# EasyEDA schematic SCH_ACVoltageSensor_2025-03-02.json
TITLE: Sensor de tensão monofásica AC 150V; REV: 1.0; Date: 2025-02-28; Sheet: 1/1; Drawn By: Lucas Yukio Fukuda Matsumoto; Company: UTFPR
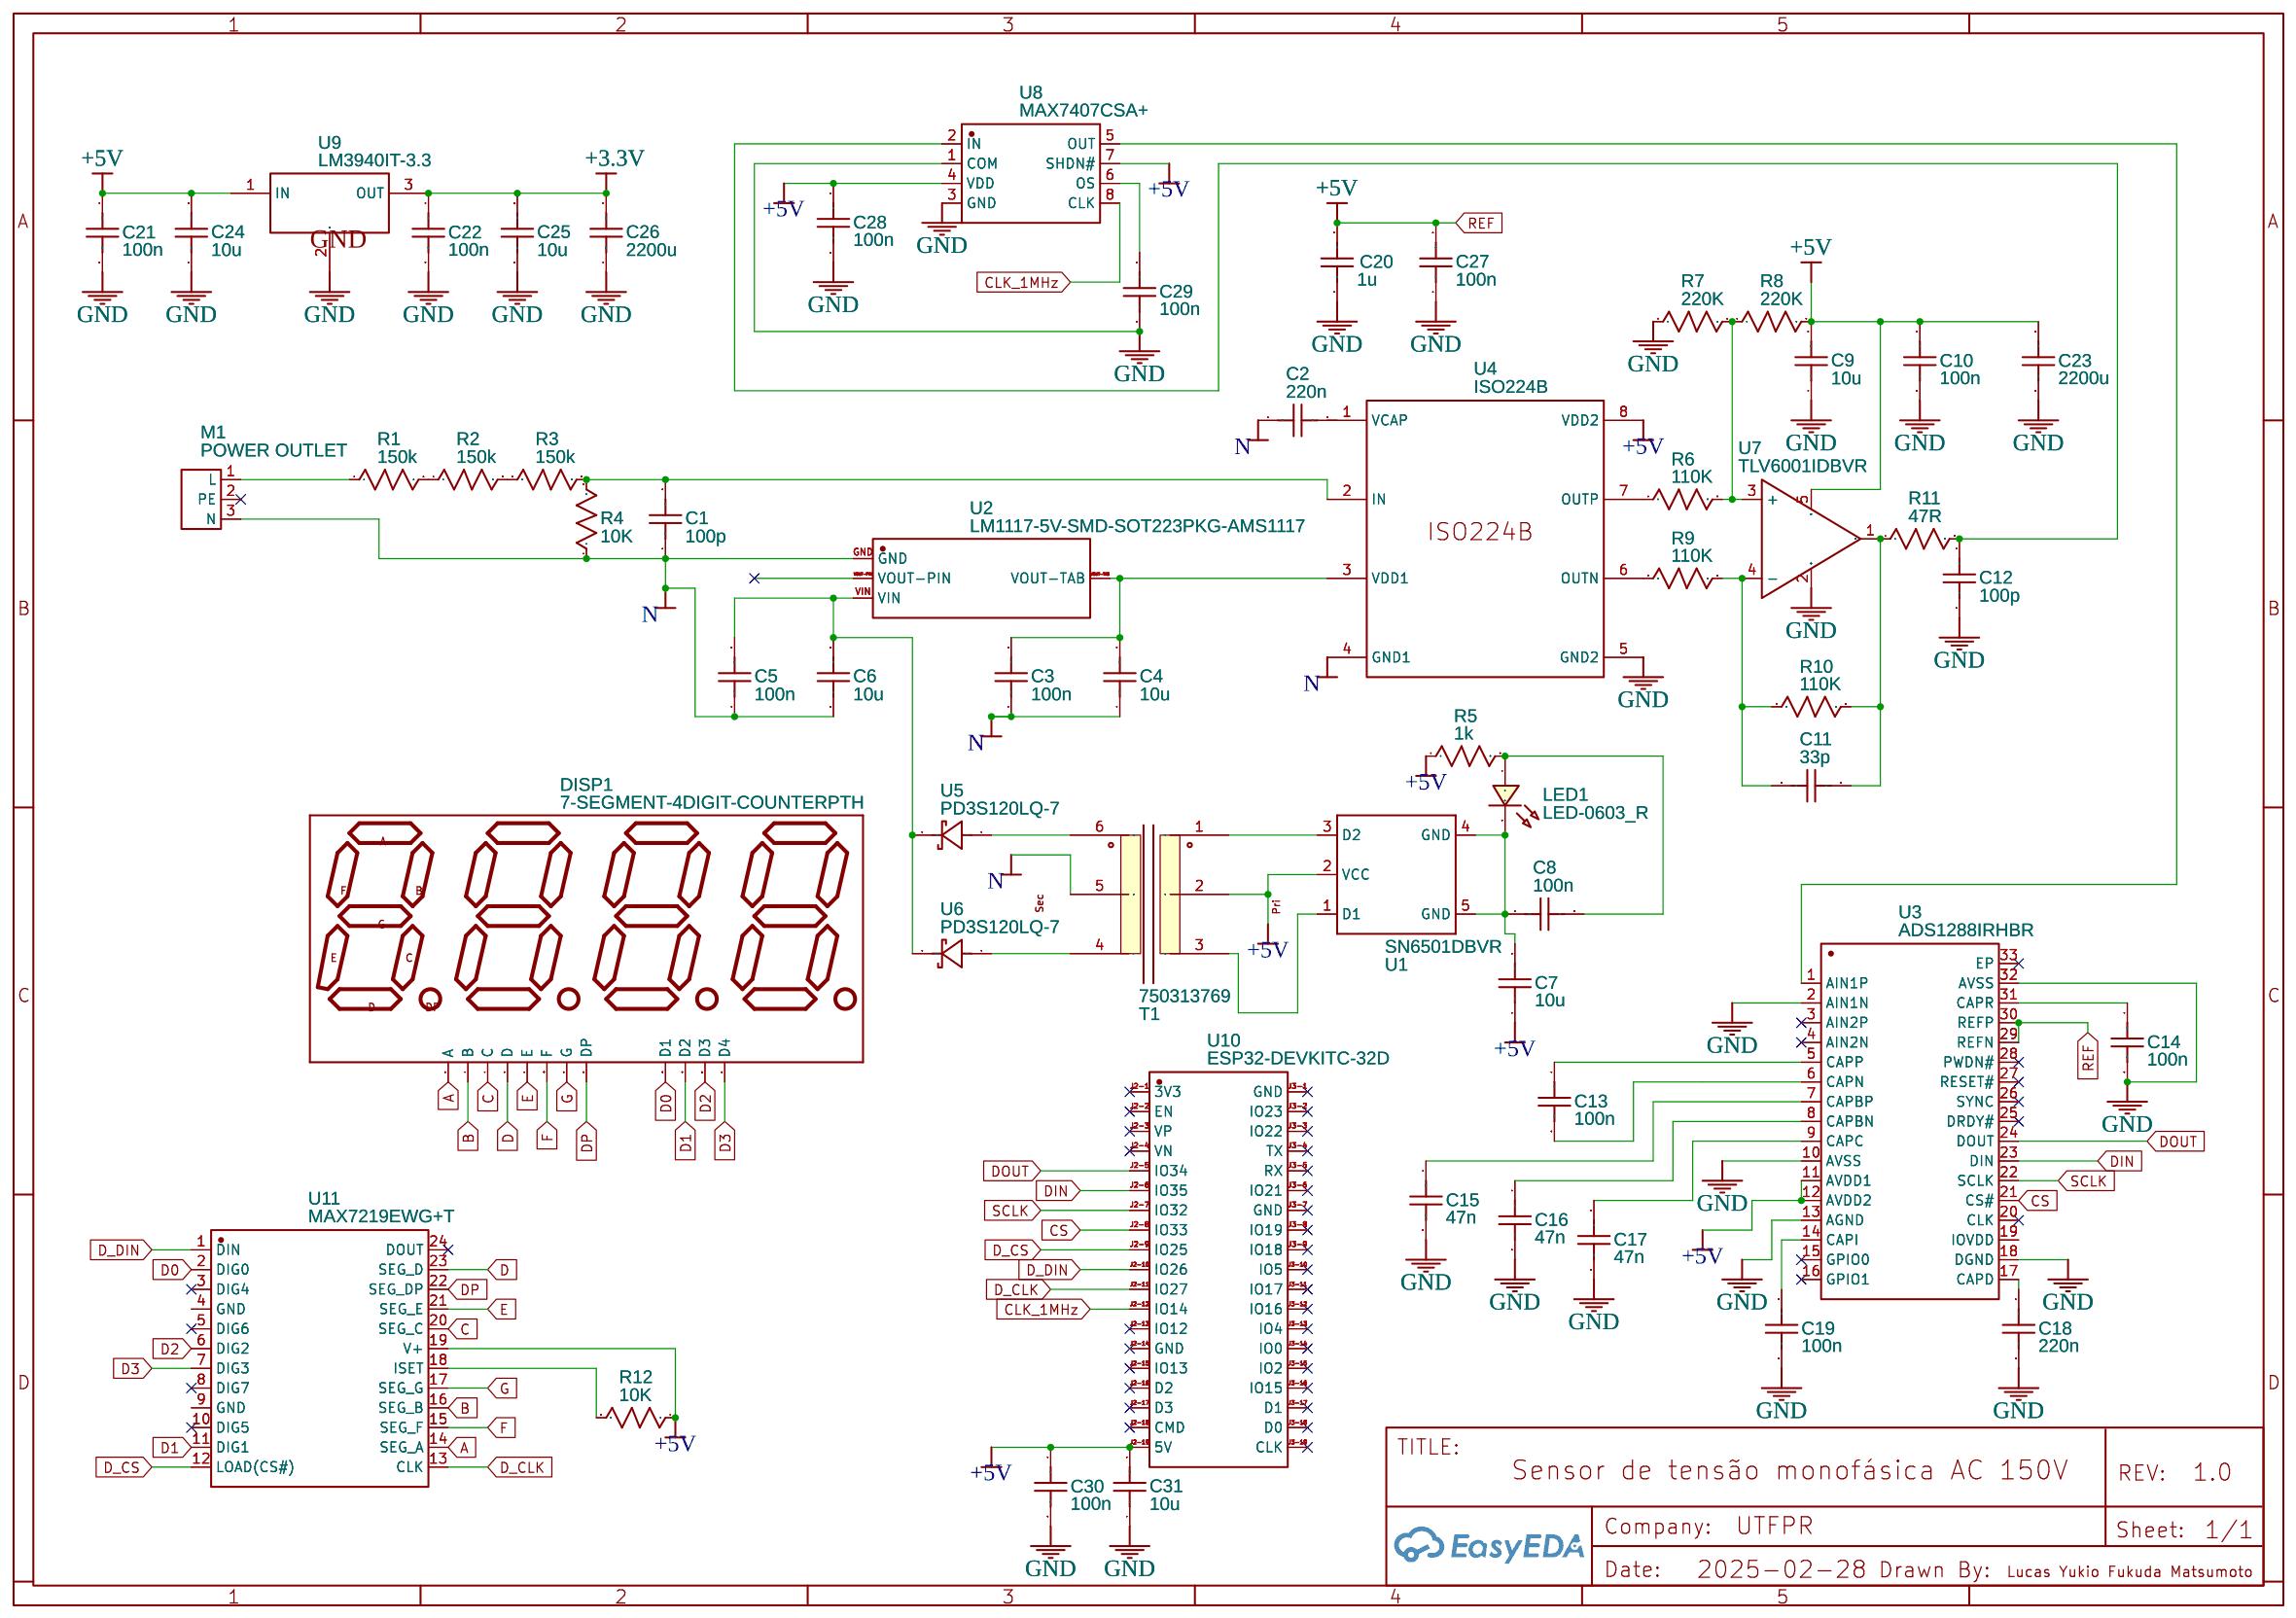
[diagram p0: schematic sheet]

## Parts
C1  100p  [C0603]
C2  220n  [C0603]
C3  100n  [C0603]
C4  10u  [C0603]
C5  100n  [C0603]
C6  10u  [C0603]
C7  10u  [C0603]
C8  100n  [C0603]
C9  10u  [C0603]
C10  100n  [C0603]
C11  33p  [C0603]
C12  100p  [C0603]
C13  100n  [C0603]
C14  100n  [C0603]
C15  47n  [C0603]
C16  47n  [C0603]
C17  47n  [C0603]
C18  220n  [C0603]
C19  100n  [C0603]
C20  1u  [C0603]
C21  100n  [C0603]
C22  100n  [C0603]
C23  2200u  [C0603]
C24  10u  [C0603]
C25  10u  [C0603]
C26  2200u  [C0603]
C27  100n  [C0603]
C28  100n  [C0603]
C29  100n  [C0603]
C30  100n  [C0603]
C31  10u  [C0603]
DISP1  7-SEGMENT-4DIGIT-COUNTERPTH  [7-SEGMENT-4DIGIT-COUNTER]
LED1  LED-0603_R  [LED0603_RED]
M1  POWER OUTLET  [POWER OUTLET]
R1  150k  [R0603]
R2  150k  [R0603]
R3  150k  [R0603]
R4  10K  [R0603]
R5  1k  [R0603]
R6  110K  [R0603]
R7  220K  [R0603]
R8  220K  [R0603]
R9  110K  [R0603]
R10  110K  [R0603]
R11  47R  [R0603]
R12  10K  [R0603]
T1  750313769  [TOROID_SMD_6PIN_(1123)]
U1  SN6501DBVR  [SOT-23-5_L3.0-W1.7-P0.95-LS2.8-BR]
U2  LM1117-5V-SMD-SOT223PKG-AMS1117  [LM1117-5V-SMD-SOT223PKG-AMS1117-FP]
U3  ADS1288IRHBR  [VQFN-32_L5.0-W5.0-P0.5-TL-EP3.5]
U4  ISO224B  [SOIC8-2.8MM]
U5  PD3S120LQ-7  [PD3S120LQ-7]
U6  PD3S120LQ-7  [PD3S120LQ-7]
U7  TLV6001IDBVR  [SOT23-5]
U8  MAX7407CSA+  [SOIC-8_L4.9-W4.0-P1.27-LS6.0-BL]
U9  LM3940IT-3.3  [TO-220-3_L10.0-W4.5-P2.54-L]
U10  ESP32-DEVKITC-32D  [COMM-SMD_ESP32-DEVKITC-32D]
U11  MAX7219EWG+T  [SOIC-24_L15.4-W7.5-P1.27-LS10.3-BL]

## Library data of the parts
C1-C31 = C_0603_US: Contributor: LCEDA_Lib
DISP1 = 7-SEGMENT-4DIGIT-COUNTERPTH: Contributor: SparkFun
LED1 = LED-0603_R: Manufacturer: EVERLIGHT(台湾亿光); Manufacturer Part: 19-217/R6C-AL1M2VY/3T; Supplier Part: C72044; Supplier: LCSC; Contributor: LCEDA_01
M1 = POWER OUTLET: Contributor: milos.cimoradsky
R1-R12 = R_0603_US: Contributor: LCEDA_Lib
T1 = 750313769: Contributor: dwaipayan.pal1
U1 = SN6501DBVR: Supplier: LCSC; Manufacturer: TI(德州仪器); Supplier Part: C49451; JLCPCB Part Class: Extended Part
U2 = LM1117-5V-SMD-SOT223PKG-AMS1117: sourceId: dwIGgezVh; Supplier: LCSC; Manufacturer: AMS; Manufacturer Part: AMS1117-3.3; Supplier Part: C6186; JLCPCB Part Class: Basic Part
U3 = ADS1288IRHBR: Supplier: LCSC; Supplier Part: C36678877; Manufacturer: null; Contributor: lcsc; JLCPCB Part Class: Extended Part
U4 = ISO224B: Manufacturer: TI; Manufacturer Part: ISO224BDWVR; Supplier: TEXAS INSTRUMENTS; Supplier Part: ISO224BDWVR; link: https://www.ti.com/product/ISO224; Contributor: Lester Yu
U5 U6 = PD3S120LQ-7: Contributor: Shant Centistoke
U7 = TLV6001IDBVR: Supplier: LCSC; Manufacturer: TI; Contributor: justinrehak
U8 = MAX7407CSA+: Supplier: LCSC; Supplier Part: C17218336; Manufacturer: ADI(亚德诺)/MAXIM(美信); Contributor: lcsc; JLCPCB Part Class: Extended Part
U9 = LM3940IT-3.3: Contributor: LCSC; Supplier: LCSC; Manufacturer: TI(德州仪器); Supplier Part: C139336; JLCPCB Part Class: Extended Part
U10 = ESP32-DEVKITC-32D: Supplier: LCSC; Supplier Part: C571181; Manufacturer: ESPRESSIF(乐鑫); Manufacturer Part: ESP32-DevKitC-32D; JLCPCB Part Class: Extended Part; Contributor: lcsc
U11 = MAX7219EWG+T: Supplier: LCSC; Manufacturer: ADI(亚德诺)/MAXIM(美信); Supplier Part: C52476; JLCPCB Part Class: Extended Part

## Nets
+3.3V: C22.1 C25.2 C26.2 U9.3(OUT)
+5V: C7.1 C9.2 C10.1 C20.2 C21.1 C23.1 C24.2 C27.2 C28.1 C30.1 C31.2 R5.1 R8.2 R12.1 T1.2 U1.2(VCC) U3.11(AVDD1) U3.12(AVDD2) U3.29(REFN) U3.30(REFP) U4.8(VDD2) U7.5(VDD) U8.4(VDD) U8.7(SHDN#) U9.1(IN) U10.J2-19(5V) U11.19(V+)
GND: C9.1 C10.2 C12.1 C14.2 C15.2 C16.2 C17.2 C18.2 C19.2 C20.1 C21.2 C22.2 C23.2 C24.1 C25.1 C26.1 C27.1 C28.2 C29.2 C30.2 C31.1 R7.1 U3.2(AIN1N) U3.10(AVSS) U3.13(AGND) U3.18(DGND) U3.32(AVSS) U4.5(GND2) U7.2(GND) U8.1(COM) U8.3(GND) U9.2(GND)
A: DISP1.11(A) U11.14(SEG A)
B: DISP1.7(B) U11.16(SEG B)
C: DISP1.4(C) U11.20(SEG C)
CLK_1MHz: U8.8(CLK) U10.J2-12(IO14)
CS: U3.21(CS#) U10.J2-8(IO33)
D: DISP1.2(D) U11.23(SEG D)
D0: DISP1.12(D1) U11.2(DIG0)
D1: DISP1.9(D2) U11.11(DIG1)
D2: DISP1.8(D3) U11.6(DIG2)
D3: DISP1.6(D4) U11.7(DIG3)
D_CLK: U10.J2-11(IO27) U11.13(CLK)
D_CS: U10.J2-9(IO25) U11.12(LOAD(CS#))
D_DIN: U10.J2-10(IO26) U11.1(DIN)
DIN: U3.23(DIN) U10.J2-6(IO35)
DOUT: U3.24(DOUT) U10.J2-5(IO34)
DP: DISP1.3(DP) U11.22(SEG DP)
E: DISP1.1(E) U11.21(SEG E)
F: DISP1.10(F) U11.15(SEG F)
G: DISP1.5(G) U11.17(SEG G)
N: C1.1 C2.1 C3.1 C4.1 C5.1 C6.1 M1.3(N) R4.1 T1.5 U2.GND U4.4(GND1)
SCLK: U3.22(SCLK) U10.J2-7(IO32)
Net-(C1-2): C1.2 R3.2 R4.2 U4.2(IN)
Net-(C3-2): C3.2 C4.2 U2.VOUT-TAB U4.3(VDD1)
Net-(C5-2): C5.2 C6.2 U2.VIN U5.2 U6.2
Net-(C7-2): C7.2 C8.1 LED1.2 U1.4(GND) U1.5(GND)
Net-(C8-2): C8.2 LED1.1 R5.2
Net-(C11-1): C11.1 R9.2 R10.1 U7.4(-)
Net-(C11-2): C11.2 R10.2 R11.1 U7.1(OUT)
Net-(C12-2): C12.2 R11.2 U8.2(IN)
Net-(C13-1): C13.1 U3.5(CAPP)
Net-(C13-2): C13.2 U3.6(CAPN)
Net-(C14-1): C14.1 U3.31(CAPR)
Net-(C15-1): C15.1 U3.7(CAPBP)
Net-(C16-1): C16.1 U3.8(CAPBN)
Net-(C17-1): C17.1 U3.9(CAPC)
Net-(C18-1): C18.1 U3.17(CAPD)
Net-(C19-1): C19.1 U3.14(CAPI)
Net-(C29-1): C29.1 U8.6(OS)
Net-(M1-1): M1.1(L) R1.1
Net-(R1-2): R1.2 R2.1
Net-(R2-2): R2.2 R3.1
Net-(R6-1): R6.1 U4.7(OUTP)
Net-(R6-2): R6.2 R7.2 R8.1 U7.3(+)
Net-(R9-1): R9.1 U4.6(OUTN)
Net-(R12-2): R12.2 U11.18(ISET)
Net-(T1-1): T1.1 U1.3(D2)
Net-(T1-3): T1.3 U1.1(D1)
Net-(T1-4): T1.4 U6.1
Net-(T1-6): T1.6 U5.1
Net-(U3-1): U3.1(AIN1P) U8.5(OUT)

Not connected (* = marked no-connect by the designer): C2 2; M1 2(PE)*; U2 VOUT-PIN; U3 3(AIN2P)* 4(AIN2N)* 15(GPIO0)* 16(GPIO1)* 19(IOVDD) 20(CLK)* 25(DRDY#)* 26(SYNC)* 27(RESET#)* 28(PWDN#)* 33(EP)*; U4 1(VCAP); U10 J2-1(3V3)* J2-2(EN)* J2-3(VP)* J2-4(VN)* J2-13(IO12)* J2-14(GND)* J2-15(IO13)* J2-16(D2)* J2-17(D3)* J2-18(CMD)* J3-1(GND)* J3-2(IO23)* J3-3(IO22)* J3-4(TX)* J3-5(RX)* J3-6(IO21)* J3-7(GND)* J3-8(IO19)* J3-9(IO18)* J3-10(IO5)* J3-11(IO17)* J3-12(IO16)* J3-13(IO4)* J3-14(IO0)* J3-15(IO2)* J3-16(IO15)* J3-17(D1)* J3-18(D0)* J3-19(CLK)*; U11 3(DIG4)* 4(GND) 5(DIG6)* 8(DIG7)* 9(GND) 10(DIG5)* 24(DOUT)*
